# EAGLE design PH-Meter (EAGLE 7.2.0)
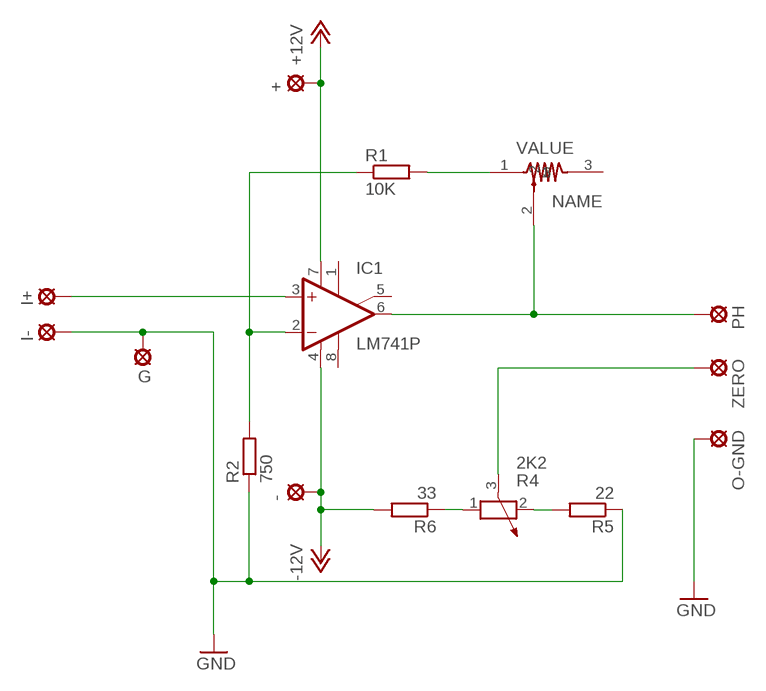
[diagram p0: schematic, sheet 1]

## Parts
+  LSP10  [LSP10]
-  LSP10  [LSP10]
G  LSP10  [LSP10]
I+  LSP10  [LSP10]
I-  LSP10  [LSP10]
IC1  LM741P  [DIL08]
O-GND  LSP10  [LSP10]
PH  LSP10  [LSP10]
R1  10K  R-EU_0207/12  [0207/12]
R2  750  R-EU_0207/12  [0207/12]
R3  2K  TRIMMER  [TRIMMER]
R4  2K2  POTENTIOMETER_PT-10  [PT-10]
R5  22  R-EU_0207/12  [0207/12]
R6  33  R-EU_0207/12  [0207/12]
ZERO  LSP10  [LSP10]

## Nets
+12V: +.MP IC1.7(V+)
-12V: -.MP IC1.4(V-) R6.2
N$1: IC1.2(-IN) R1.1 R2.2
N$2: R1.2 R3.1
N$3: IC1.6(OUT) PH.MP R3.2
N$4: I+.MP IC1.3(+IN)
N$6: G.MP I-.MP O-GND.MP R2.1 R5.1 ; supply symbol labelled GND
N$7: R4.1 R6.1
N$8: R4.3 ZERO.MP
N$9: R4.2 R5.2
Unconnected: IC1.1(ON1) IC1.5(ON2) IC1.8(OPT) R3.3

## Library data of the parts
+ - G I+ I- O-GND PH ZERO = solpad:LSP10: SOLDER PAD drill 1.0 mm, distributor Buerklin, 12H555
IC1 = linear:*741: OP AMP
R1 R2 R5 R6 = resistor:R-EU_: RESISTOR, European symbol
R3 = Erik:TRIMMER: trimmer
R4 = rcl:POTENTIOMETER_: Potentiometer

## Board
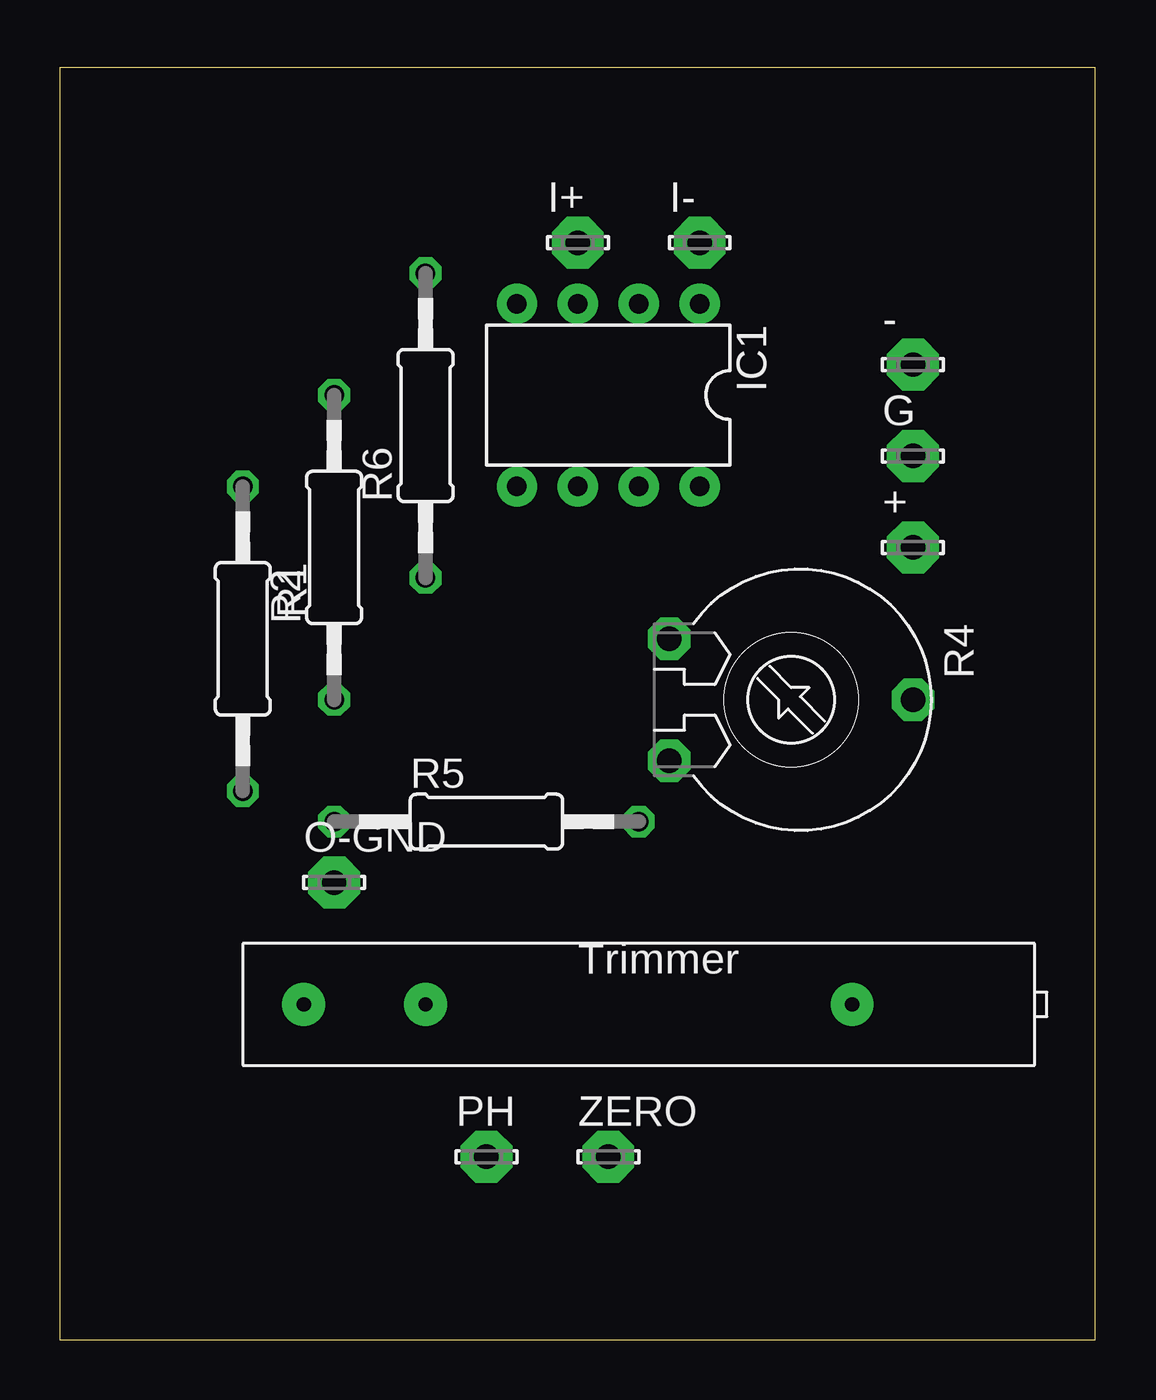
[diagram p1: board, top side]
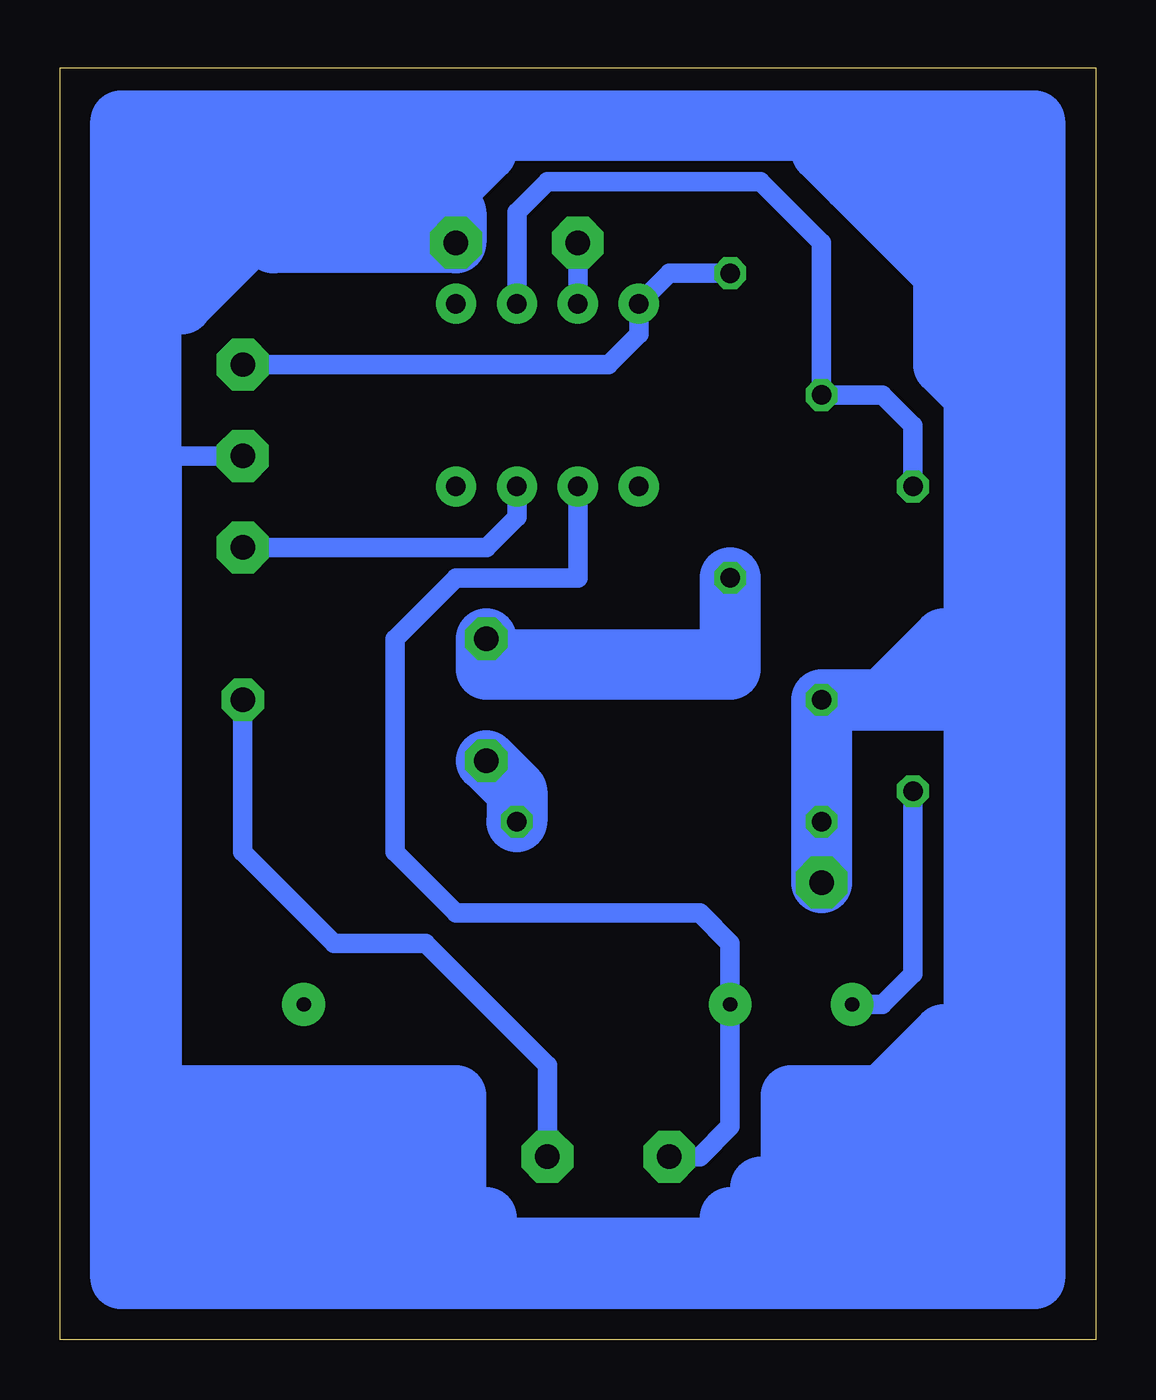
[diagram p2: board, bottom side, seen from below]

Size 43.16 x 53.01 mm. Coordinates in mm from the lower left corner, seen from the top.
Outline: 0,0 43.16,0 43.16,53.01 0,53.01 0,0
Copper layers (1*16): Top 0.035mm / dielectric 1.5mm / Bottom 0.035mm
Design rules "default": minimum track width 10mil, minimum drill 24mil, track to track 8mil, track to pad 8mil, pad to pad 8mil, via to via 8mil, smd to smd 8mil, copper to edge 40mil, drill to drill 8mil, minimum pad ring 10mil, minimum via ring 8mil, stop-mask expansion 4mil, vias tented up to drill 0mil, thermal gap 10mil

### Footprints (pad centres in the part's own frame; a part is rotated, then mirrored left to right if it is on the bottom)
LSP10 = drill 1.016 pad 2.159 octagon: MP 0,0
DIL08 = drill 0.813 pad 1.676: 1 -3.81,-3.81; 2 -1.27,-3.81; 3 1.27,-3.81; 4 3.81,-3.81; 5 3.81,3.81; 6 1.27,3.81; 7 -1.27,3.81; 8 -3.81,3.81
0207/12 = drill 0.813 octagon: 1 -6.35,0; 2 6.35,0
TRIMMER = drill 0.6 pad 1.778: 1 -13.97,0; 2 -8.89,0; 3 8.89,0
PT-10 = drill 1.016 pad 1.778 octagon: 1 -2.54,-5.08; 2 2.54,-5.08; 3 0,5.08

### Placement (x,y rotation side)
+  35.56,33.02 0 top
-  35.56,40.64 0 top
G  35.56,36.83 0 top
I+  21.59,45.72 0 top
I-  26.67,45.72 0 top
IC1  22.86,39.37 180 top
O-GND  11.43,19.05 0 top
PH  17.78,7.62 0 top
R1  7.62,29.21 270 top
R2  11.43,33.02 90 top
R3  24.13,13.97 0 top
R4  30.48,26.67 270 top
R5  17.78,21.59 0 top
R6  15.24,38.1 90 top
ZERO  22.86,7.62 0 top

### Tracks (layer width: path | path; a pad name or v marks a point on that pad's centre or on a via)
+12V
  Bottom 0.813: IC1.7 24.13,34.29 25.4,33.02 +.MP
-12V
  Bottom 0.813: -.MP 31.75,40.64 20.32,40.64 19.05,41.91 IC1.4 17.78,44.45 R6.2
N$1
  Bottom 0.813: R1.1 7.62,38.1 8.89,39.37 R2.2 11.43,45.72 13.97,48.26 22.86,48.26 24.13,46.99 24.13,45.72 24.13,44.45 IC1.2
N$2
  Bottom 0.813: R1.2 7.62,15.24 8.89,13.97 R3.1
N$3
  Bottom 0.813: PH.MP 16.51,7.62 15.24,8.89 R3.2 15.24,16.51 16.51,17.78 26.67,17.78 29.21,20.32 29.21,29.21 26.67,31.75 24.13,31.75 22.86,31.75 21.59,31.75 IC1.6
N$4
  Bottom 0.813: I+.MP IC1.3
N$6
  Bottom 0.813: R2.1 R5.1 O-GND.MP | 26.67,49.53 25.4,49.53 11.43,49.53 5.08,49.53 2.54,49.53 2.54,26.67 6.35,26.67 | 26.67,49.53 34.29,49.53 35.56,49.53 36.83,49.53 39.37,46.99 39.37,44.45 | 39.37,36.83 G.MP | 26.67,46.99 26.67,48.26 26.67,49.53
  Bottom 2.54: 40.64,48.26 40.64,2.54 2.54,2.54 2.54,50.8 10.16,50.8 | 40.64,48.26 40.64,50.8 10.16,50.8 | 40.64,48.26 38.1,48.26 38.1,49.53 | 10.16,50.8 10.16,48.26 | 10.16,48.26 6.35,44.45 6.35,40.64 5.08,39.37 3.81,39.37 | 5.08,49.53 5.08,5.08 | 5.08,5.08 5.08,3.81 | 5.08,5.08 15.24,5.08 15.24,3.81 25.4,3.81 25.4,5.08 26.67,5.08 | 26.67,5.08 39.37,5.08 39.37,7.62 | 39.37,10.16 39.37,36.83 39.37,44.45 | 39.37,44.45 39.37,49.53 35.56,49.53 | 34.29,49.53 39.37,44.45 | 39.37,44.45 38.1,43.18 33.02,48.26 26.67,48.26 25.4,49.53 | 26.67,5.08 26.67,10.16 39.37,10.16 | 39.37,10.16 39.37,7.62 | 39.37,7.62 38.1,6.35 27.94,6.35 27.94,8.89 29.21,7.62 38.1,7.62 | 10.16,48.26 11.43,49.53 | 6.35,29.21 8.89,26.67 R2.1 | R2.1 6.35,26.67 | R2.1 O-GND.MP | I-.MP 34.29,45.72 33.02,46.99 26.67,46.99 I-.MP
N$7
  Bottom 0.813: R6.1 15.24,29.21 R4.1
  Bottom 2.54: R6.1 15.24,27.94 25.4,27.94 R4.1
N$8
  Bottom 0.813: ZERO.MP 22.86,11.43 27.94,16.51 31.75,16.51 35.56,20.32 R4.3
N$9
  Bottom 2.54: R4.2 24.13,22.86 R5.2
N$10
  Bottom 2.54: 6.35,12.7 8.89,10.16 | 8.89,10.16 12.7,6.35 | 12.7,6.35 13.97,6.35 | 12.7,6.35 6.35,6.35 6.35,10.16 8.89,7.62 | 8.89,10.16 12.7,10.16 12.7,7.62
N$11
  Bottom 2.54: 6.35,46.99 7.62,48.26 | 7.62,48.26 8.89,48.26 | 7.62,48.26 6.35,48.26